# Altium schematic sheet ESC Board Sample.SchDoc
size A
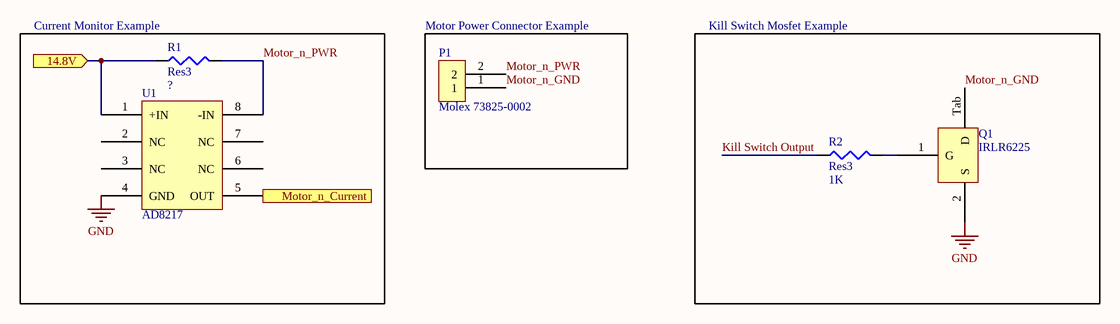
[diagram p0: ESC Board Sample.SchDoc]

## Parts
P1  Molex 73825-0002  [Molex 76825-0002]
Q1  IRLR6225  [IRLR6225]
R1  Res3  [J1-0603]
R2  Res3  value 1K  [J1-0603]
U1  AD8217  [AD8217]

## Blocks framed on the sheet
Current Monitor Example: R1 U1
Motor Power Connector Example: P1
Kill Switch Mosfet Example: Q1 R2

## Ports
14.8V (in), Motor_n_Current (out)

## Nets
GND: Q1.2(S) U1.4(GND)
14.8V: R1.1 U1.1(+IN) ; port 14.8V
Kill Switch Output: R2.1
Motor_n_Current: U1.5(OUT) ; port Motor_n_Current
Motor_n_GND: P1.1 Q1.Tab(D)
Motor_n_PWR: P1.2 R1.2 U1.8(-IN)
NetQ1_1: Q1.1(G) R2.2

Not connected (* = marked no-connect by the designer): U1 2(NC) 3(NC) 6(NC) 7(NC)

## Library data of the parts
R1 R2 = Res3: Resistor; Published: 8-Jun-2000; LatestRevisionDate: 29-May-2009; LatestRevisionNote: IPC-7351 Footprint Added.; PackageReference: J1-0603; Publisher: Altium Limited; PackageDescription: Chip Resistor
  R1: Value: ?
P1 = Molex 73825-0002: ComponentLink1Description: Drawing; ComponentLink1URL: https://www.molex.com/pdm_docs/sd/768250002_sd.pdf; ComponentLink2Description: Molex Website; ComponentLink2URL: https://www.molex.com/molex/products/datasheet.jsp?part=active/0768250002_PCB_HEADERS.xml; ComponentLink3Description: Digi-Key; ComponentLink3URL: https://www.digikey.com/products/en?keywords=76825-0002